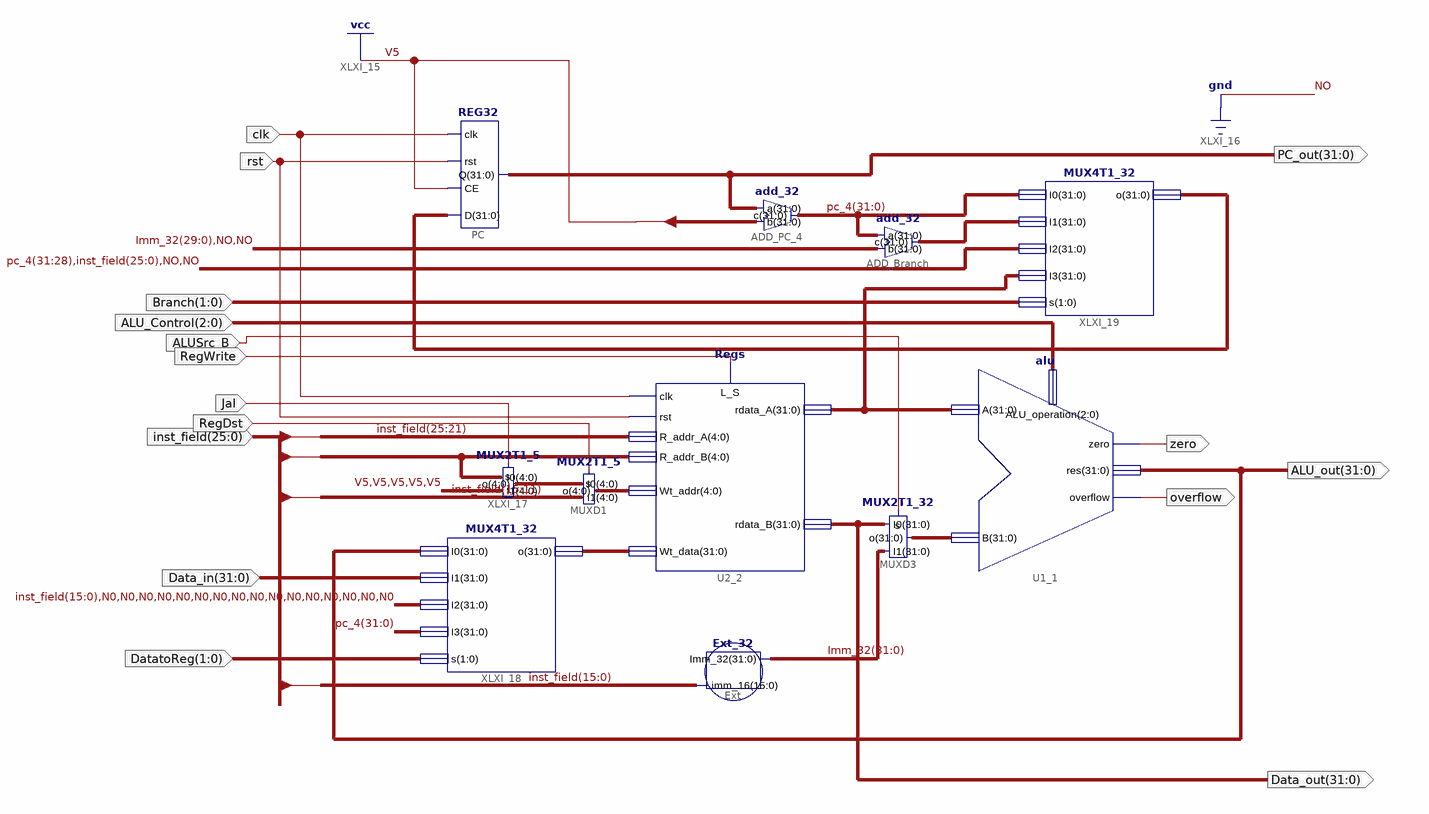
[diagram p0: schematic sheet 1]
// Xilinx ISE schematic Data_path.sch (kintex7) as structural Verilog: 11 symbols, 16 ports
module Data_path (
  input  [25:0] inst_field,
  input  RegDst,
  input  [1:0] DatatoReg,
  input  [31:0] Data_in,
  input  rst,
  input  clk,
  input  [1:0] Branch,
  input  [2:0] ALU_Control,
  input  ALUSrc_B,
  input  RegWrite,
  input  Jal,
  output [31:0] PC_out,
  output [31:0] ALU_out,
  output [31:0] Data_out,
  output zero,
  output overflow
);

  wire N0;
  wire [4:0] XLXN_6, XLXN_59;
  wire [31:0] Imm_32, pc_4, XLXN_10, XLXN_24, XLXN_32, XLXN_53, XLXN_54;

  Ext_32 Ext (.imm_16(inst_field[15:0]), .Imm_32(Imm_32));
  add_32 ADD_PC_4 (.c(pc_4), .a(PC_out), .b({{29{N0}}, 1'b1, {2{N0}}}));
  add_32 ADD_Branch (.c(XLXN_24), .a(pc_4), .b({Imm_32[29:0], 2'b00}));
  MUX2T1_5 MUXD1 (.I1(inst_field[15:11]), .I0(XLXN_59), .o(XLXN_6), .s(RegDst));
  MUX2T1_32 MUXD3 (.s(ALUSrc_B), .I0(Data_out), .I1(Imm_32), .o(XLXN_54));
  REG32 PC (.D(XLXN_32), .CE(1'b1), .rst(rst), .clk(clk), .Q(PC_out));
  alu U1_1 (.zero(zero), .res(ALU_out), .overflow(overflow), .A(XLXN_53), .B(XLXN_54), .ALU_operation(ALU_Control));
  Regs U2_2 (
    .clk(clk), .L_S(RegWrite), .rdata_A(XLXN_53), .rst(rst), .Wt_data(XLXN_10), .rdata_B(Data_out),
    .R_addr_A(inst_field[25:21]), .R_addr_B(inst_field[20:16]), .Wt_addr(XLXN_6));
  MUX2T1_5 XLXI_17 (.I1({5{1'b1}}), .I0(inst_field[20:16]), .o(XLXN_59), .s(Jal));
  MUX4T1_32 XLXI_18 (
    .I0(ALU_out), .I1(Data_in), .I2({inst_field[15:0], {16{N0}}}), .I3(pc_4), .s(DatatoReg), .o(XLXN_10));
  MUX4T1_32 XLXI_19 (
    .I0(pc_4), .I1(XLXN_24), .I2({pc_4[31:28], inst_field, 2'b00}), .I3(XLXN_53), .s(Branch), .o(XLXN_32));
endmodule
